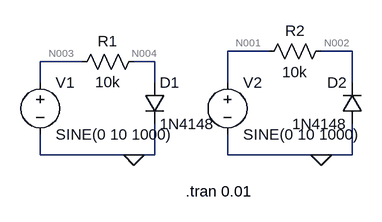
[diagram p0: schematic Draft7.asc]
Draft7.asc, the LTspice schematic file:
Version 4.1
SHEET 1 880 680
WIRE 400 48 336 48
WIRE 528 48 480 48
WIRE 112 64 48 64
WIRE 224 64 192 64
WIRE 48 96 48 64
WIRE 224 96 224 64
WIRE 336 96 336 48
WIRE 528 96 528 48
WIRE 48 208 48 176
WIRE 192 208 48 208
WIRE 224 208 224 160
WIRE 224 208 192 208
WIRE 336 208 336 176
WIRE 480 208 336 208
WIRE 528 208 528 160
WIRE 528 208 480 208
FLAG 192 208 0
FLAG 480 208 0
SYMBOL voltage 48 80 R0
WINDOW 123 0 0 Left 0
WINDOW 39 0 0 Left 0
SYMATTR InstName V1
SYMATTR Value SINE(0 10 1000)
SYMBOL voltage 336 80 R0
WINDOW 123 0 0 Left 0
WINDOW 39 0 0 Left 0
SYMATTR InstName V2
SYMATTR Value SINE(0 10 1000)
SYMBOL res 208 48 R90
WINDOW 0 0 56 VBottom 2
WINDOW 3 32 56 VTop 2
SYMATTR InstName R1
SYMATTR Value 10k
SYMBOL res 496 32 R90
WINDOW 0 0 56 VBottom 2
WINDOW 3 32 56 VTop 2
SYMATTR InstName R2
SYMATTR Value 10k
SYMBOL diode 208 96 R0
SYMATTR InstName D1
SYMATTR Value 1N4148
SYMBOL diode 544 160 R180
WINDOW 0 24 64 Left 2
WINDOW 3 24 0 Left 2
SYMATTR InstName D2
SYMATTR Value 1N4148
TEXT 272 264 Left 2 !.tran 0.01

The netlist it stands for:
* Draft7.asc
V1 N003 0 SINE(0 10 1000)
V2 N001 0 SINE(0 10 1000)
R1 N004 N003 10k
R2 N002 N001 10k
D1 N004 0 1N4148
D2 0 N002 1N4148
.model D D
.lib standard.dio
.tran 0.01
.backanno
.end

* Results of the author's LTspice run, read from the files saved beside the schematic
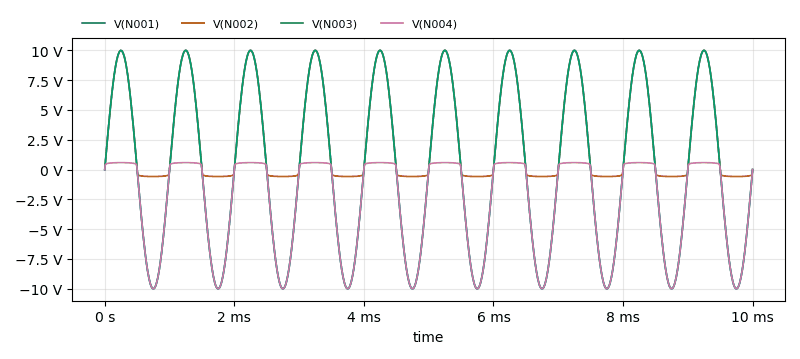
[diagram p1: Transient Analysis of Draft7.asc, plotted from the saved traces]
* Transient Analysis, 1 run:
*   V(N001): min -10 V, max 9.999 V, average -282.1 µV, rms 7.071 V, last 0 V
*   V(N002): min -582 mV, max 9.999 V, average 2.912 V, rms 5.015 V, last -2.455 mV
*   V(N003): min -10 V, max 9.999 V, average -282.1 µV, rms 7.071 V, last 0 V
*   V(N004): min -10 V, max 582 mV, average -2.912 V, rms 5.015 V, last -2.488 mV